# EAGLE design seven (EAGLE 5.11)
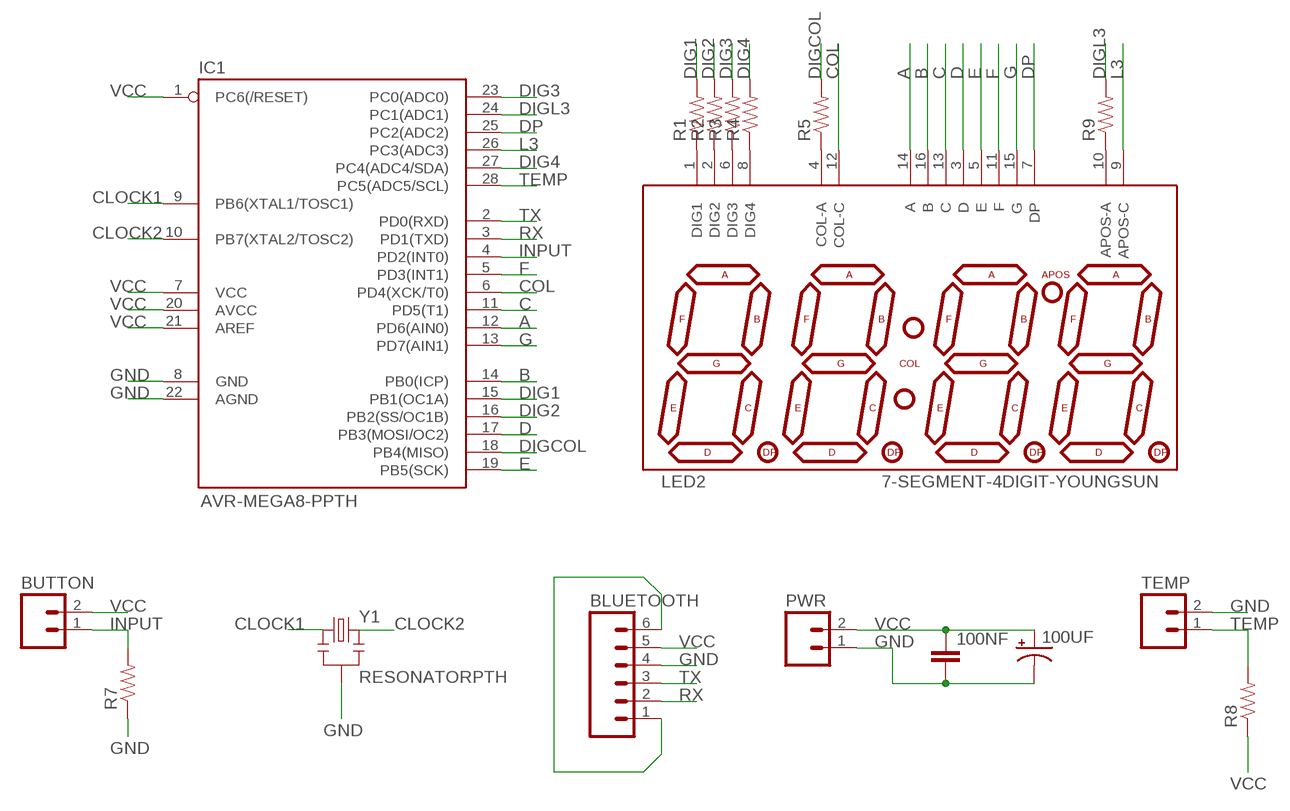
[diagram p0: schematic, sheet 1]

## Parts
100NF  CAPPTH1  [CAP-PTH-5MM]
100UF  CAP_POLPTH1  [CPOL-RADIAL-100UF-25V]
BLUETOOTH  M06SIP  [1X06]
BUTTON  M02PTH  [1X02]
IC1  AVR-MEGA8-PPTH  [DIL28-3]
LED2  7-SEGMENT-4DIGIT-YOUNGSUN  [7-SEGMENT-4DIGIT-YOUNGSUN]
PWR  M02PTH  [1X02]
R1  RESISTORPTH-1/6W  [1/6W-RES]
R2  RESISTORPTH-1/6W  [1/6W-RES]
R3  RESISTORPTH-1/6W  [1/6W-RES]
R4  RESISTORPTH-1/6W  [1/6W-RES]
R5  RESISTORPTH-1/6W  [1/6W-RES]
R7  RESISTORPTH-1/6W  [1/6W-RES]
R8  RESISTORPTH-1/6W  [1/6W-RES]
R9  RESISTORPTH-1/6W  [1/6W-RES]
TEMP  M02PTH  [1X02]
Y1  RESONATORPTH  [RESONATOR-PTH]

## Nets
A: IC1.12(PD6(AIN0)) LED2.14(A)
B: IC1.14(PB0(ICP)) LED2.16(B)
C: IC1.11(PD5(T1)) LED2.13(C)
CLOCK1: IC1.9(PB6(XTAL1/TOSC1)) Y1.1
CLOCK2: IC1.10(PB7(XTAL2/TOSC2)) Y1.3
COL: IC1.6(PD4(XCK/T0)) LED2.12(COL-C)
D: IC1.17(PB3(MOSI/OC2)) LED2.3(D)
DIG1: IC1.15(PB1(OC1A)) R1.2
DIG2: IC1.16(PB2(SS/OC1B)) R2.2
DIG3: IC1.23(PC0(ADC0)) R3.2
DIG4: IC1.27(PC4(ADC4/SDA)) R4.2
DIGCOL: IC1.18(PB4(MISO)) R5.2
DIGL3: IC1.24(PC1(ADC1)) R9.2
DP: IC1.25(PC2(ADC2)) LED2.7(DP)
E: IC1.19(PB5(SCK)) LED2.5(E)
F: IC1.5(PD3(INT1)) LED2.11(F)
G: IC1.13(PD7(AIN1)) LED2.15(G)
GND: 100NF.2 100UF.2(-) BLUETOOTH.4 IC1.8(GND) IC1.22(AGND) PWR.1 R7.1 TEMP.2 Y1.2
INPUT: BUTTON.1 IC1.4(PD2(INT0)) R7.2
L3: IC1.26(PC3(ADC3)) LED2.9(APOS-C)
N$1: LED2.1(DIG1) R1.1
N$2: LED2.2(DIG2) R2.1
N$3: LED2.6(DIG3) R3.1
N$4: LED2.8(DIG4) R4.1
N$5: LED2.4(COL-A) R5.1
N$6: LED2.10(APOS-A) R9.1
N$8: BLUETOOTH.1 BLUETOOTH.6
RX: BLUETOOTH.2 IC1.3(PD1(TXD))
TEMP: IC1.28(PC5(ADC5/SCL)) R8.2 TEMP.1
TX: BLUETOOTH.3 IC1.2(PD0(RXD))
VCC: 100NF.1 100UF.1(+) BLUETOOTH.5 BUTTON.2 IC1.1(PC6(/RESET)) IC1.7(VCC) IC1.20(AVCC) IC1.21(AREF) PWR.2 R8.1

## Library data of the parts
100NF = SparkFun:CAP: Capacitor Standard 0603 ceramic capacitor, and 0.1" leaded capacitor.
100UF = SparkFun:CAP_POL: Capacitor Polarized These are standard SMD and PTH capacitors. Normally 10uF, 47uF, and 100uF in electrolytic and tantalum varieties. Always verify the external diameter of the through hole cap, it varies with capacity, voltage, and manufacturer. The EIA devices should be standard.
BLUETOOTH = SparkFun:M06: Header 6 Standard 6-pin 0.1" header. Use with straight break away headers (SKU : PRT-00116), right angle break away headers (PRT-00553), swiss pins (PRT-00743), machine pins (PRT-00117), and female headers (PRT-00115). Molex polarized connector foot print use with SKU : PRT-08094 with associated crimp pins and housings. NOTES ON THE VARIANTS LOCK and LOCK_LONGPADS... This footprint was designed to help hold the alignment of a through-hole component (i.e. 6-pin header) while soldering it into place. You may notice that each hole has been shifted either up or down by 0.005 of an inch from it's more standard position (which is a perfectly straight line). This slight alteration caused the pins (the squares in the middle) to touch the edges of the holes. Because they are alternating, it causes a "brace" to hold the component in place. 0.005 has proven to be the perfect amount of "off-center" position when using our standard breakaway headers. Although looks a little odd when you look at the bare footprint, once you have a header in there, the alteration is very hard to notice. Also, if you push a header all the way into place, it is covered up entirely on the bottom side. This idea of altering the position of holes to aid alignment will be further integrated into the Sparkfun Library for other footprints. It can help hold any component with 3 or more connection pins.
BUTTON PWR TEMP = SparkFun:M02: Header 2 Standard 2-pin 0.1" header. Use with straight break away headers (SKU : PRT-00116), right angle break away headers (PRT-00553), swiss pins (PRT-00743), machine pins (PRT-00117), and female headers (PRT-00115). Molex polarized connector foot print use with SKU : PRT-08233 with associated crimp pins and housings.
IC1 = SparkFun:AVR-MEGA8-P: MICROCONTROLLER 8 Kbytes FLASH 1 kbytes SRAM 512 bytes EEPROM USART 4-channel 10 bit ADC 2-channel 8 bit ADC
LED2 = SparkFun:7-SEGMENT-4DIGIT-YOUNGSUN: This is a part for the 4-Digit 7-segment LEDs from Young Sun. Different from the Digikey LEDs, all 16 pins are used. The LONGPADS Variant is used for a test jig, but you may like it because there is more pad to solder to. If you are concerned about routing space, the standard works just fine though.
R1-R5 R7-R9 = SparkFun:RESISTOR: Resistor Basic schematic elements and footprints for 0603, 1206, and PTH resistors.
Y1 = SparkFun:RESONATOR: Resonator Small SMD resonator. This is the itty bitty 10/20MHz resonators with built in caps. CSTCE10M0G55 and CSTCE20M0V53. Footprint has been reviewed closely but hasn't been tested yet.

## Board
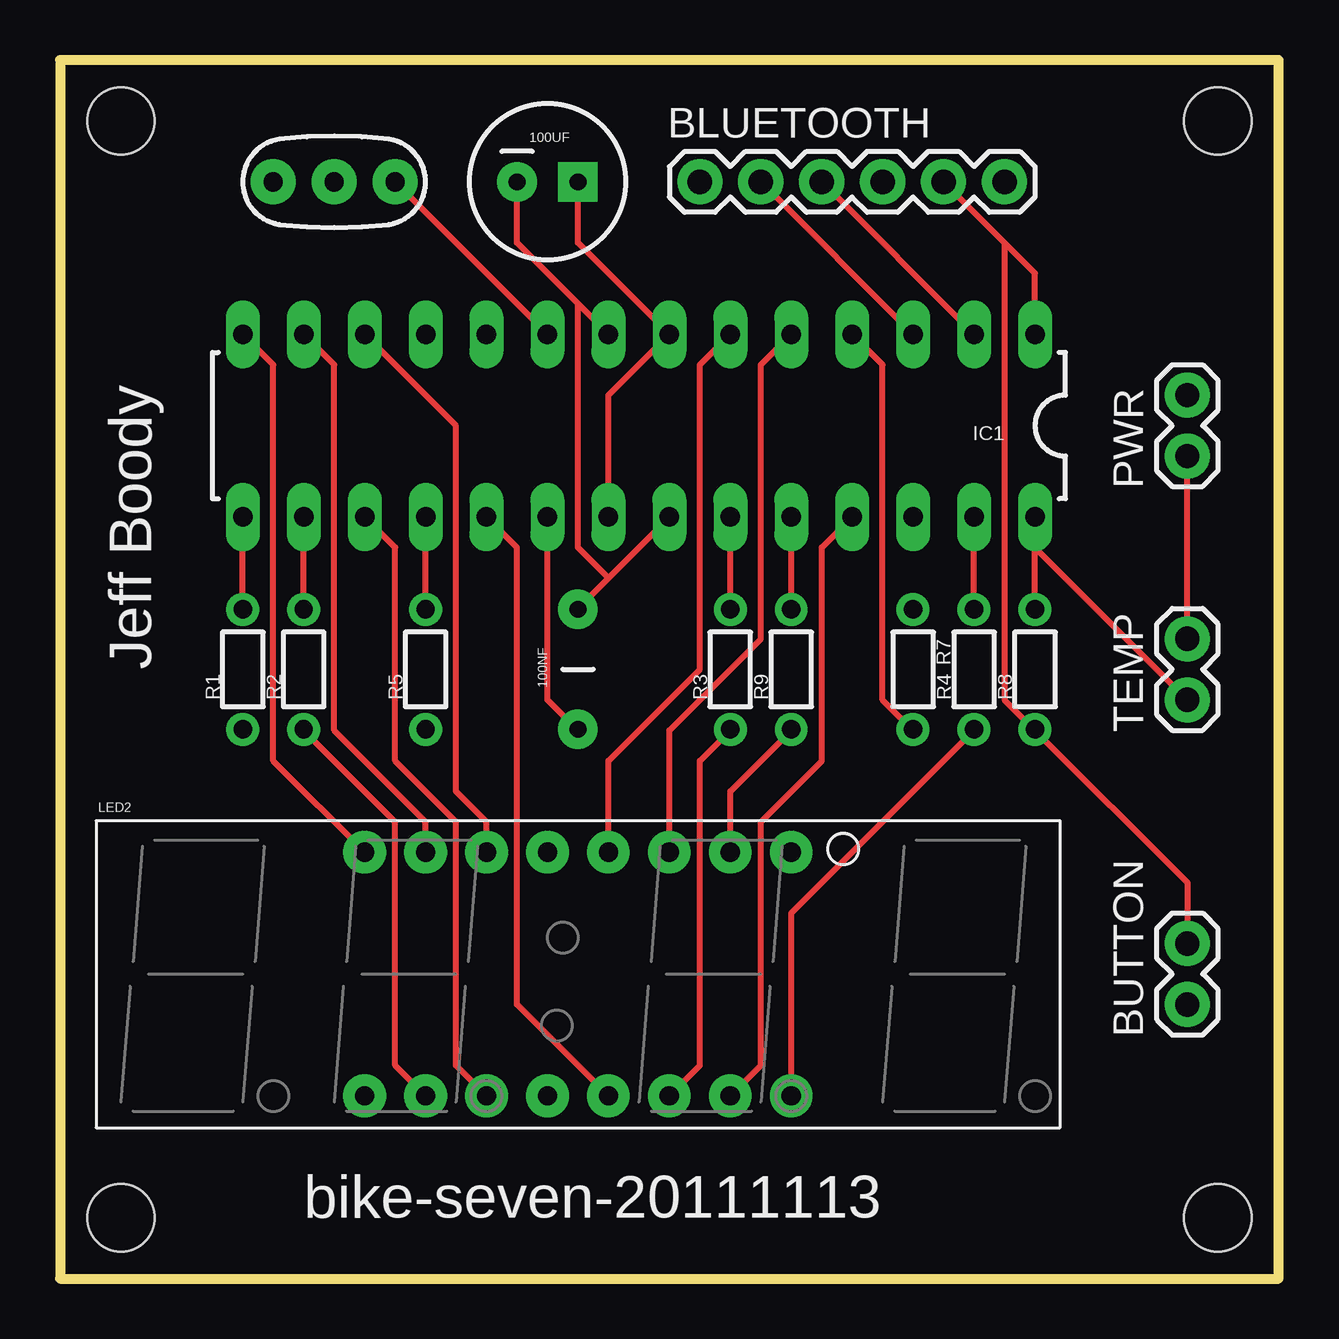
[diagram p1: board, top side]
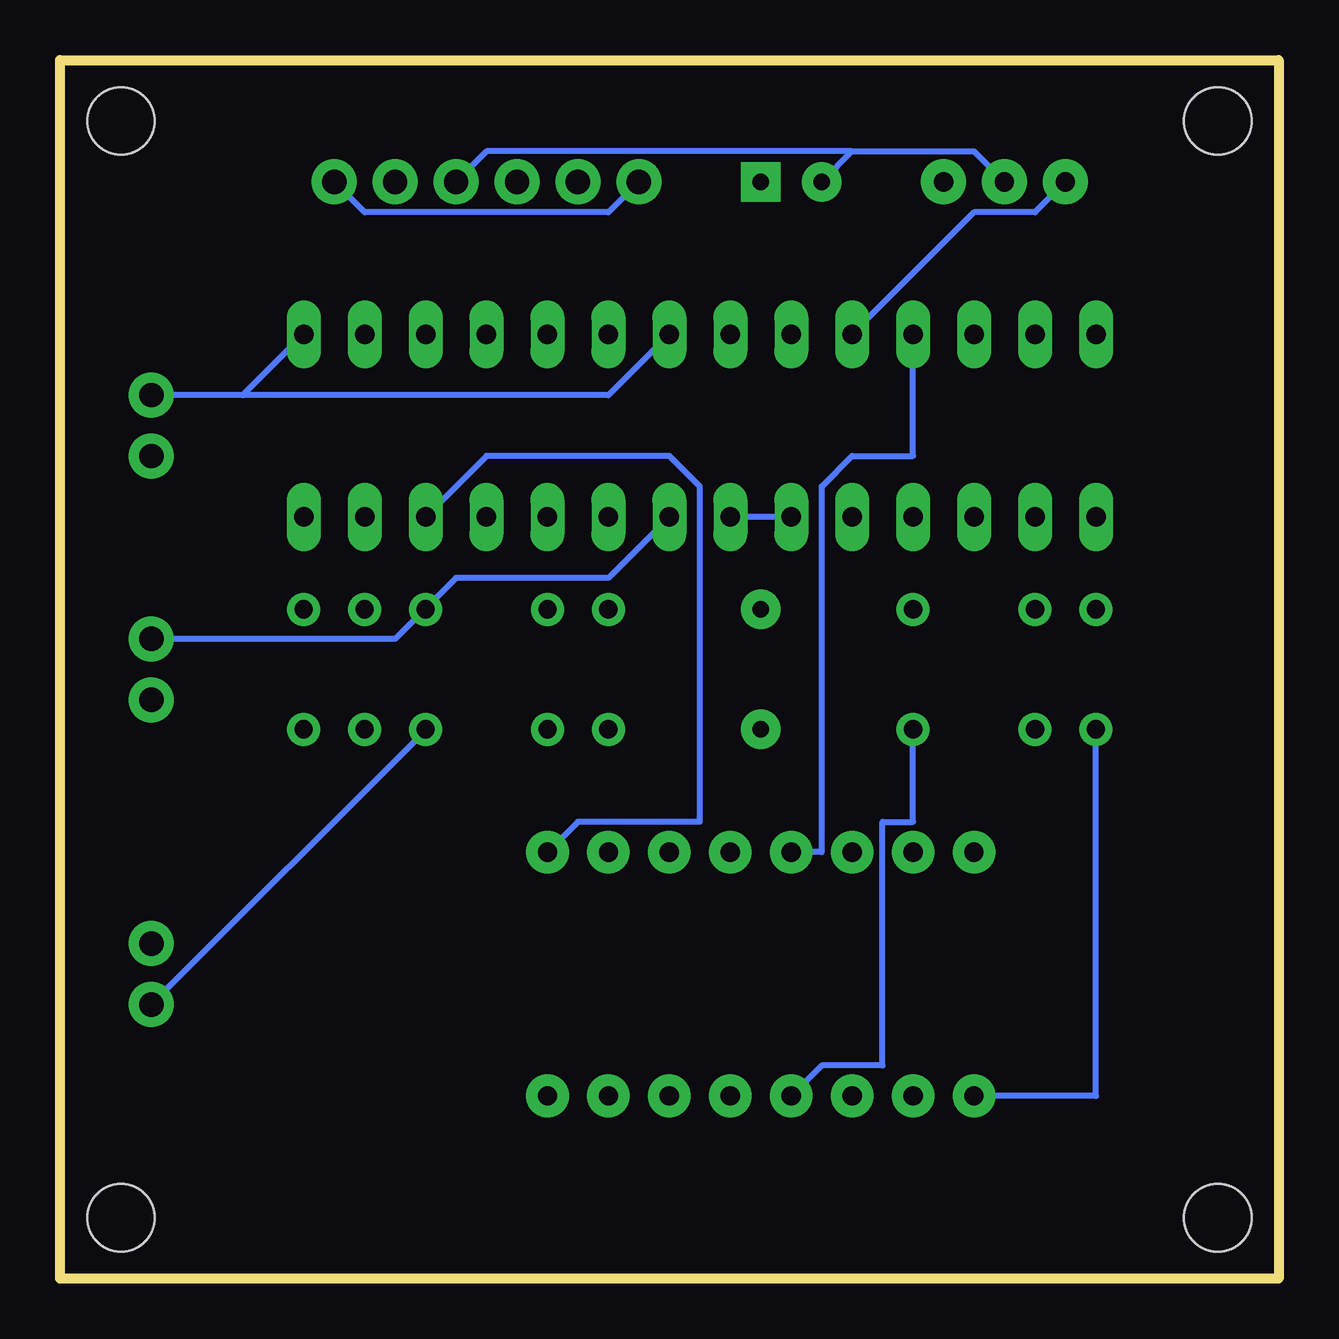
[diagram p2: board, bottom side, seen from below]

Size 50.8 x 50.8 mm. Coordinates in mm from the lower left corner, seen from the top.
Outline: 0,0 50.8,0 50.8,50.8 0,50.8 0,0
Copper layers (1*16): Top 0.035mm / dielectric 1.5mm / Bottom 0.035mm
Design rules "SparkFun": minimum track width 8mil, minimum drill 20mil, track to track 8mil, track to pad 8mil, pad to pad 8mil, via to via 8mil, smd to smd 8mil, copper to edge 10mil, drill to drill 8mil, minimum pad ring 12mil, minimum via ring 10mil, stop-mask expansion 4mil, vias tented up to drill 25mil, thermal gap 10mil
Holes 2.8 mm at 2.54,2.54 48.26,2.54 2.54,48.26 48.26,48.26

### Footprints (pad centres in the part's own frame; a part is rotated, then mirrored left to right if it is on the bottom)
CAP-PTH-5MM = drill 0.7 pad 1.651 round: 1 -2.5,0; 2 2.5,0
CPOL-RADIAL-100UF-25V = drill 0.7 pad 1.651 square: 1 1.27,0 | drill 0.7 pad 1.651 round: 2 -1.27,0
1X06 = drill 1.016 pad 1.88 round: 1 0,0; 2 2.54,0; 3 5.08,0; 4 7.62,0; 5 10.16,0; 6 12.7,0
1X02 = drill 1.016 pad 1.88 round: 1 0,0; 2 2.54,0
DIL28-3 = drill 0.813 long: 1 -16.51,-3.81; 2 -13.97,-3.81; 3 -11.43,-3.81; 4 -8.89,-3.81; 5 -6.35,-3.81; 6 -3.81,-3.81; 7 -1.27,-3.81; 8 1.27,-3.81; 9 3.81,-3.81; 10 6.35,-3.81; 11 8.89,-3.81; 12 11.43,-3.81; 13 13.97,-3.81; 14 16.51,-3.81; 15 16.51,3.81; 16 13.97,3.81; 17 11.43,3.81; 18 8.89,3.81; 19 6.35,3.81; 20 3.81,3.81; 21 1.27,3.81; 22 -1.27,3.81; 23 -3.81,3.81; 24 -6.35,3.81; 25 -8.89,3.81; 26 -11.43,3.81; 27 -13.97,3.81; 28 -16.51,3.81
7-SEGMENT-4DIGIT-YOUNGSUN = drill 0.8 pad 1.778 round: 1 -8.89,-5.08; 2 -6.35,-5.08; 3 -3.81,-5.08; 4 -1.27,-5.08; 5 1.27,-5.08; 6 3.81,-5.08; 7 6.35,-5.08; 8 8.89,-5.08; 9 8.89,5.08; 10 6.35,5.08; 11 3.81,5.08; 12 1.27,5.08; 13 -1.27,5.08; 14 -3.81,5.08; 15 -6.35,5.08; 16 -8.89,5.08
1/6W-RES = drill 0.762 round: 1 -2.5,0; 2 2.5,0
RESONATOR-PTH = drill 0.8 pad 1.88 round: 1 -2.54,0; 2 0,0; 3 2.54,0

### Placement (x,y rotation side)
100NF  21.59,25.4 90 top
100UF  20.32,45.72 0 top
BLUETOOTH  26.67,45.72 0 top
BUTTON  46.99,11.43 90 top
IC1  24.13,35.56 180 top
LED2  21.59,12.7 0 top
PWR  46.99,34.29 90 top
R1  7.62,25.4 90 top
R2  10.16,25.4 90 top
R3  27.94,25.4 90 top
R4  38.1,25.4 90 top
R5  15.24,25.4 90 top
R7  35.56,25.4 270 top
R8  40.64,25.4 90 top
R9  30.48,25.4 90 top
TEMP  46.99,24.13 90 top
Y1  11.43,45.72 180 top

### Tracks (layer width: path | path; a pad name or v marks a point on that pad's centre or on a via)
A
  Top 0.254: IC1.12 16.51,35.56 16.51,20.32 17.78,19.05 LED2.14
B
  Top 0.254: IC1.14 8.89,38.1 8.89,21.59 LED2.16
C
  Bottom 0.254: IC1.11 15.24,34.29 17.78,34.29 19.05,33.02 19.05,17.78 LED2.13
CLOCK1
  Top 0.254: Y1.1 IC1.9
CLOCK2
  Bottom 0.254: IC1.10 12.7,44.45 10.16,44.45 Y1.3
COL
  Top 0.254: IC1.6 26.67,38.1 26.67,25.4 22.86,21.59 LED2.12
D
  Top 0.254: IC1.17 13.97,30.48 13.97,21.59 16.51,19.05 16.51,8.89 LED2.3
DIG1
  Top 0.254: R1.2 IC1.15
DIG2
  Top 0.254: R2.2 IC1.16
DIG3
  Top 0.254: R3.2 IC1.23
DIG4
  Top 0.254: R4.2 IC1.27
DIGCOL
  Top 0.254: R5.2 IC1.18
DIGL3
  Top 0.254: R9.2 IC1.24
DP
  Top 0.254: IC1.25 31.75,30.48 31.75,21.59 29.21,19.05 29.21,8.89 LED2.7
E
  Top 0.254: IC1.19 19.05,30.48 19.05,11.43 LED2.5
F
  Top 0.254: IC1.5 29.21,38.1 29.21,26.67 25.4,22.86 LED2.11
G
  Top 0.254: IC1.13 11.43,38.1 11.43,22.86 15.24,19.05 LED2.15
GND
  Top 0.254: TEMP.2 PWR.1 | 22.86,29.21 21.59,27.94 100NF.2 | 22.86,29.21 IC1.22 | 21.59,40.64 19.05,43.18 100UF.2 | 21.59,40.64 IC1.8 | 22.86,29.21 21.59,30.48 21.59,40.64
  Bottom 0.254: 35.56,27.94 36.83,26.67 TEMP.2 | Y1.2 12.7,46.99 17.78,46.99 | 100UF.2 17.78,46.99 | BLUETOOTH.4 33.02,46.99 17.78,46.99 | 35.56,27.94 34.29,29.21 27.94,29.21 IC1.22 | 35.56,27.94 R7.1
INPUT
  Top 0.254: IC1.4 34.29,38.1 34.29,24.13 35.56,22.86 R7.2
  Bottom 0.254: BUTTON.1 35.56,22.86 R7.2
L3
  Bottom 0.254: IC1.26 33.02,34.29 25.4,34.29 24.13,33.02 24.13,19.05 29.21,19.05 LED2.9
N$1
  Bottom 0.254: LED2.1 7.62,7.62 R1.1
N$2
  Top 0.254: LED2.2 13.97,8.89 13.97,19.05 10.16,22.86 R2.1
N$3
  Top 0.254: LED2.6 26.67,8.89 26.67,21.59 27.94,22.86 R3.1
N$4
  Top 0.254: LED2.8 30.48,15.24 38.1,22.86 R4.1
N$5
  Bottom 0.254: LED2.4 19.05,8.89 16.51,8.89 16.51,19.05 15.24,19.05 R5.1
N$6
  Top 0.254: LED2.10 27.94,20.32 30.48,22.86 R9.1
N$8
  Bottom 0.254: BLUETOOTH.1 27.94,44.45 38.1,44.45 BLUETOOTH.6
RX
  Top 0.254: IC1.3 BLUETOOTH.2
TEMP
  Top 0.254: R8.2 40.64,30.48 | 40.64,30.48 TEMP.1 | 40.64,30.48 IC1.28
TX
  Top 0.254: IC1.2 BLUETOOTH.3
VCC
  Top 0.254: 100UF.1 21.59,43.18 IC1.7 22.86,36.83 IC1.21 | IC1.20 20.32,24.13 21.59,22.86 100NF.1 | 40.64,22.86 46.99,16.51 BUTTON.2 | 39.37,43.18 40.64,41.91 IC1.1 | 39.37,43.18 BLUETOOTH.5 | 40.64,22.86 39.37,24.13 39.37,43.18 | 40.64,22.86 R8.1
  Bottom 0.254: IC1.20 IC1.21 | 43.18,36.83 IC1.1 | 43.18,36.83 PWR.2 | IC1.7 27.94,36.83 43.18,36.83

### Text on the board
tPlace: Jeff Boody | bike-seven-20111113